# Altium project ArduinoFOC.PrjPCB
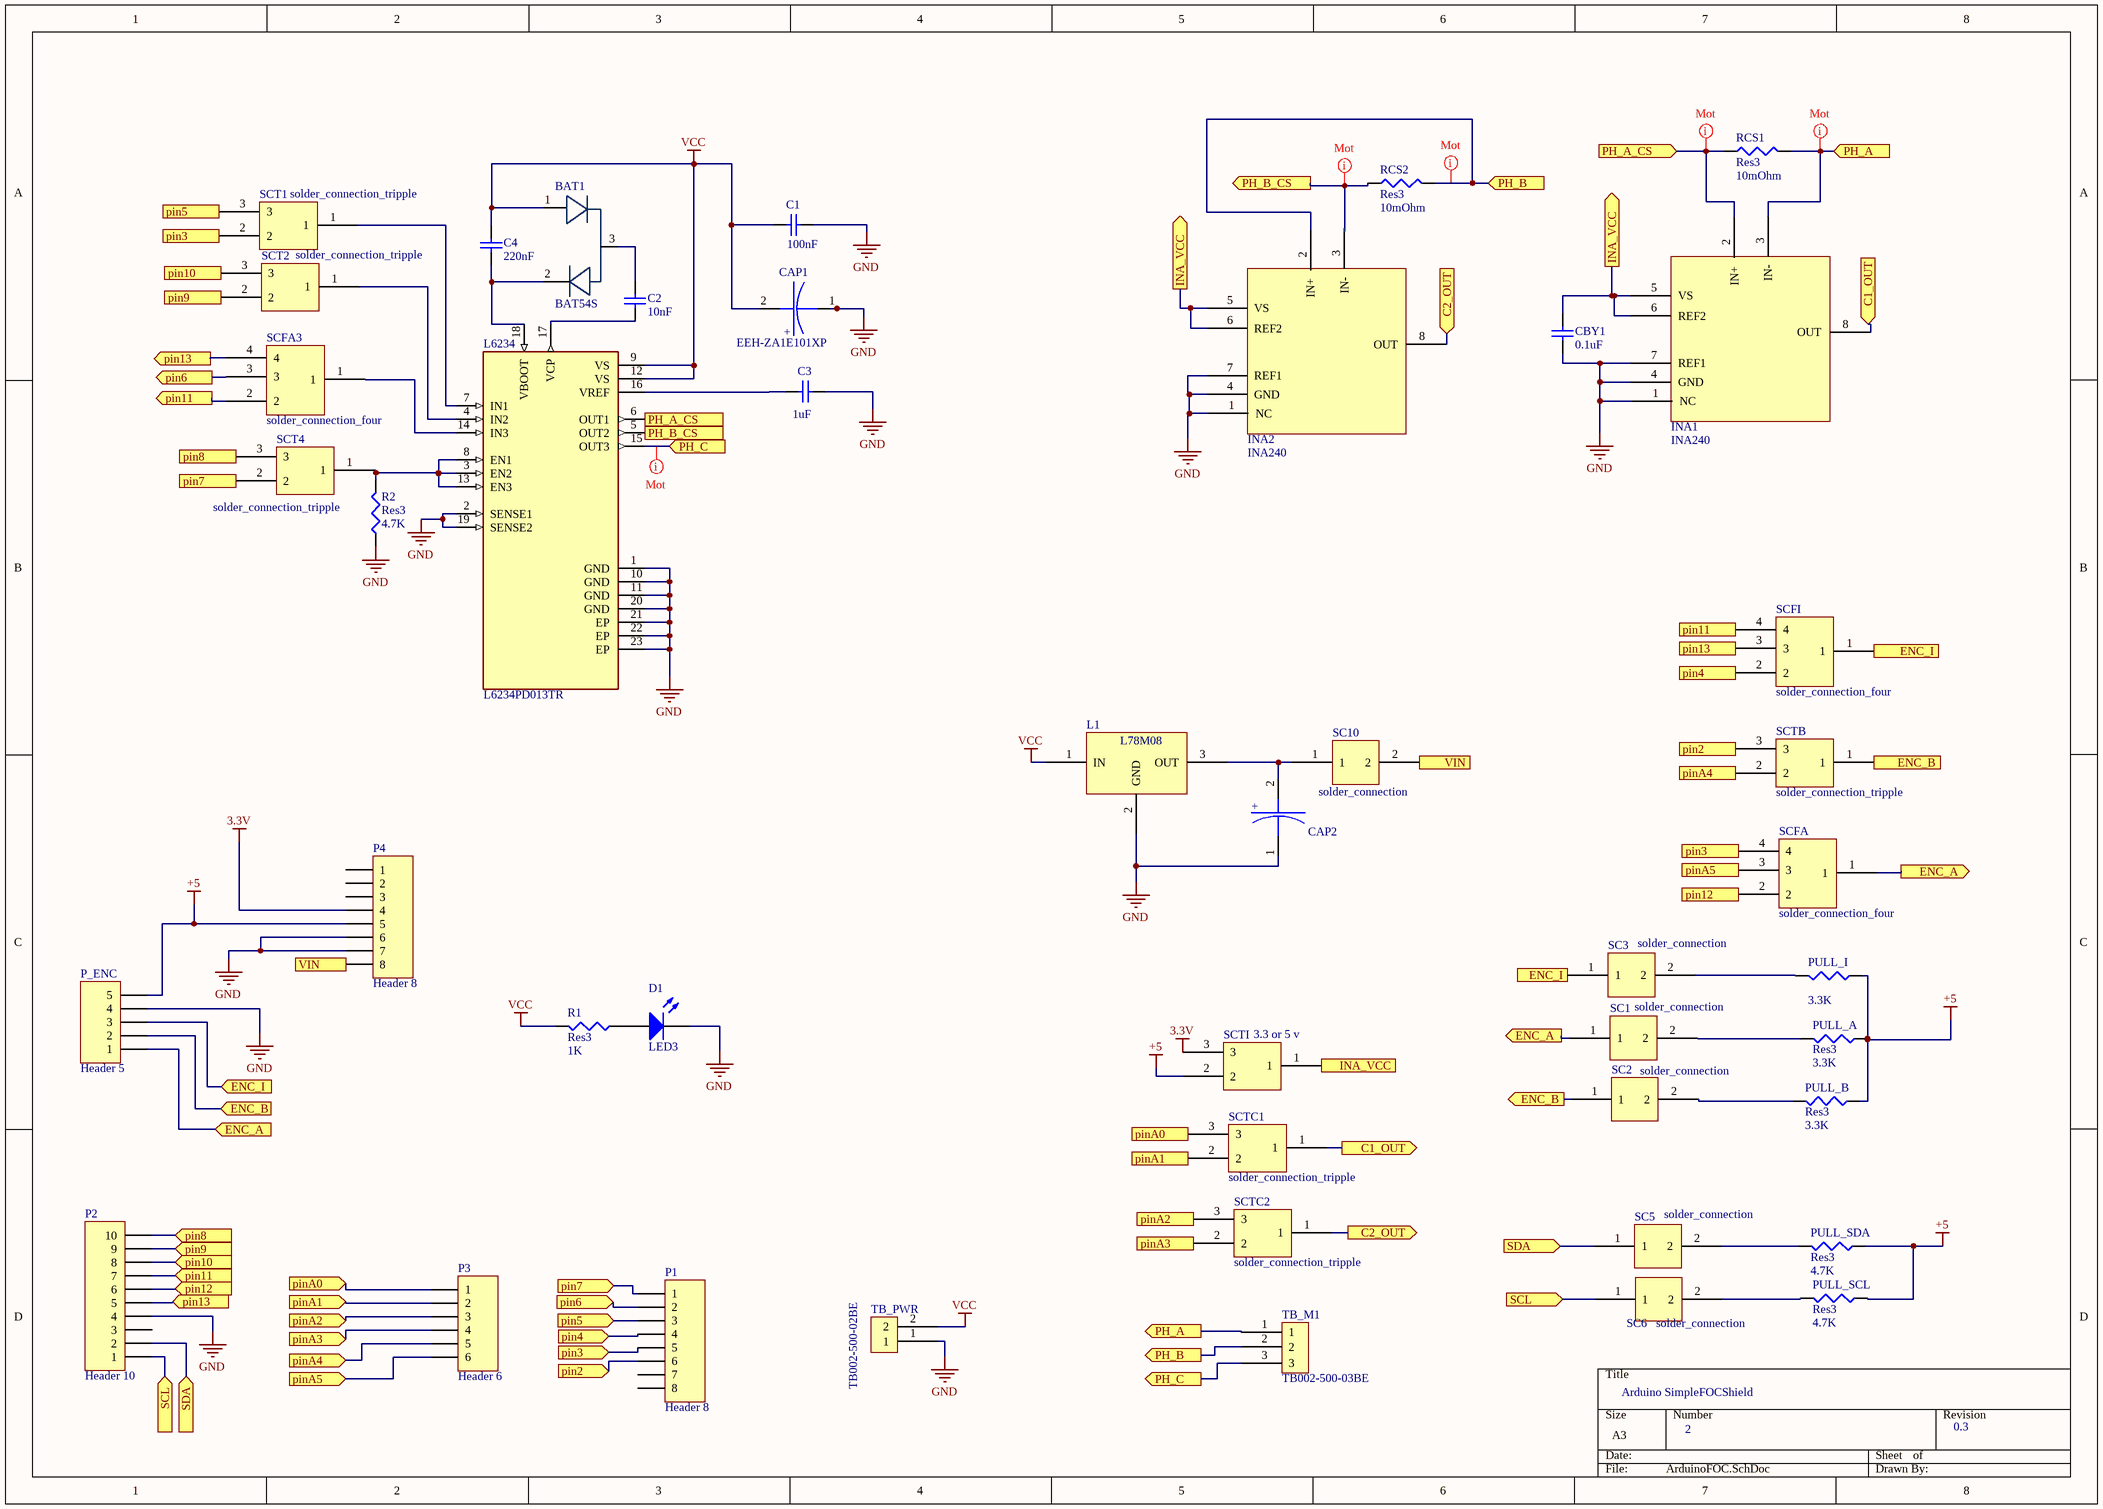
[diagram p0: ArduinoFOC.SchDoc]
1 sheet, 45 parts. Net scope: flat (ports and power ports of the same name join across sheets).
Board file: ArduinoFOC.PcbDoc

## Sheet ArduinoFOC.SchDoc
size A3

### Parts
BAT1  BAT54S  [BAT54s]
C1  value 100nF  [C1206]  (hidden comment: Cap Semi)
C2  value 10nF  [C1206]  (hidden comment: Cap Semi)
C3  value 1uF  [C1206]  (hidden comment: Cap Semi)
C4  value 220nF  [C1206]  (hidden comment: Cap Semi)
CAP1  EEH-ZA1E101XP  [EEH-ZA1E101XP]
CAP2  VZH100M1HTR-0606  [EEH-ZA1E101XP]  (value not drawn)
CBY1  value 0.1uF  [C1206]  (hidden comment: Cap Semi)
D1  LED3  [3.5X2.8X1.9]
INA1  INA240  [INA240]
INA2  INA240  [INA240]
L1  l78M08  [L7805]  (value not drawn)
L6234  L6234PD013TR  [SOIC127P1420X360-21N]
P1  Header 8  [HDR1X8]
P2  Header 10  [HDR1X10]
P3  Header 6  [HDR1X6]
P4  Header 8  [HDR1X8]
P_ENC  Header 5  [HDR1X5]
PULL_A  Res3  value 3.3K  [14-1210]
PULL_B  Res3  value 3.3K  [14-1210]
PULL_I  value 3.3K  [14-1210]  (hidden comment: Res3)
PULL_SCL  Res3  value 4.7K  [14-1210]
PULL_SDA  Res3  value 4.7K  [14-1210]
R1  Res3  value 1K  [14-1210]
R2  Res3  value 4.7K  [14-1210]
RCS1  Res3  value 10mOhm  [RESC6332]
RCS2  Res3  value 10mOhm  [RESC6332]
SC1  solder_connection  [solder_connection]
SC2  solder_connection  [solder_connection]
SC3  solder_connection  [solder_connection]
SC5  solder_connection  [solder_connection]
SC6  solder_connection  [solder_connection]
SC10  solder_connection  [solder_connection]
SCFA  solder_connection_four  [solder_connection_four]
SCFA3  solder_connection_four  [solder_connection_four]
SCFI  solder_connection_four  [solder_connection_four]
SCT1  solder_connection_tripple  [solder_connection_tripple]
SCT2  solder_connection_tripple  [solder_connection_tripple]
SCT4  solder_connection_tripple  [solder_connection_tripple]
SCTB  solder_connection_tripple  [solder_connection_tripple]
SCTC1  solder_connection_tripple  [solder_connection_tripple]
SCTC2  solder_connection_tripple  [solder_connection_tripple]
SCTI  3.3 or 5 v  [solder_connection_tripple]
TB_M1  TB002-500-03BE  [TB002-500-03BE]
TB_PWR  TB002-500-02BE  [TB002-500-02BE]

### Ports
C1_OUT (in), C1_OUT (out), C2_OUT (in), C2_OUT (out), ENC_A (in), ENC_A (out), ENC_B (in), ENC_B (out), ENC_I (in), ENC_I (out), INA_VCC (out), PH_A (in), PH_A (out), PH_A_CS (in), PH_B (in), PH_B (out), PH_B_CS (in), PH_B_CS (out), PH_C (in), PH_C (out), pin2 (in), pin2 (out), pin3 (in), pin3 (out), pin4 (in), pin4 (out), pin5 (in), pin5 (out), pin6 (in), pin6 (out), pin7 (in), pin7 (out), pin8 (in), pin9 (in), pin9 (out), pin10 (in), pin10 (out), pin11 (in), pin11 (out), pin12 (in), pin12 (out), pin13 (in), pin13 (out), pinA0 (in), pinA0 (out), pinA1 (in), pinA1 (out), pinA2 (in), pinA2 (out), pinA3 (in), pinA3 (out), pinA4 (in), pinA4 (out), pinA5 (in), pinA5 (out), SCL (in), SDA (in), VIN (in)

### Nets
3.3V: P4.4 SCTI.3
+5: P4.5 P_ENC.5 PULL_A.1 PULL_B.1 PULL_I.1 PULL_SCL.1 PULL_SDA.1 SCTI.2
GND: C1.2 C3.2 CAP1.1 CAP2.1 CBY1.1 D1.2(K) INA1.1(NC) INA1.4(GND) INA1.7(REF1) INA2.1(NC) INA2.4(GND) INA2.7(REF1) L1.2(GND) L6234.1(GND) L6234.2(SENSE1) L6234.10(GND) L6234.11(GND) L6234.19(SENSE2) L6234.20(GND) L6234.21(EP) L6234.22(EP) L6234.23(EP) P2.4 P4.6 P4.7 P_ENC.4 R2.1 TB_PWR.1
VCC: BAT1.1 C1.1 C4.1 CAP1.2(+) L1.1(IN) L6234.9(VS) L6234.12(VS) R1.2 TB_PWR.2
NetBAT1_2: BAT1.2 C4.2 L6234.18(VBOOT)
NetBAT1_3: BAT1.3 C2.2
NetC2_1: C2.1 L6234.17(VCP)
NetC3_1: C3.1 L6234.16(VREF)
NetCAP2_2: CAP2.2(+) L1.3(OUT) SC10.1
NetCBY1_2: CBY1.2 INA1.5(VS) INA1.6(REF2) INA2.5(VS) INA2.6(REF2) SCTI.1 ; port INA_VCC
NetD1_1: D1.1(A) R1.1
NetINA1_2: INA1.2(IN+) L6234.6(OUT1) RCS1.1 ; port PH_A_CS
NetINA1_3: INA1.3(IN-) RCS1.2 TB_M1.1 ; port PH_A
NetINA1_8: INA1.8(OUT) SCTC1.1 ; port C1_OUT
NetINA2_2: INA2.2(IN+) RCS2.2 TB_M1.2 ; port PH_B
NetINA2_3: INA2.3(IN-) L6234.5(OUT2) RCS2.1 ; port PH_B_CS
NetINA2_8: INA2.8(OUT) SCTC2.1 ; port C2_OUT
NetL6234_3: L6234.3(EN2) L6234.8(EN1) L6234.13(EN3) R2.2 SCT4.1
NetL6234_4: L6234.4(IN2) SCT2.1
NetL6234_7: L6234.7(IN1) SCT1.1
NetL6234_14: L6234.14(IN3) SCFA3.1
NetL6234_15: L6234.15(OUT3) TB_M1.3 ; port PH_C
NetP1_1: P1.1 SCT4.2 ; port pin7
NetP1_2: P1.2 SCFA3.3 ; port pin6
NetP1_3: P1.3 SCT1.3 ; port pin5
NetP1_4: P1.4 SCFI.2 ; port pin4
NetP1_5: P1.5 SCFA.4 SCT1.2 ; port pin3
NetP1_6: P1.6 SCTB.3 ; port pin2
NetP2_1: P2.1 SC6.1 ; port SCL
NetP2_2: P2.2 SC5.1 ; port SDA
NetP2_5: P2.5 SCFA3.4 SCFI.3 ; port pin13
NetP2_6: P2.6 SCFA.2 ; port pin12
NetP2_7: P2.7 SCFA3.2 SCFI.4 ; port pin11
NetP2_8: P2.8 SCT2.3 ; port pin10
NetP2_9: P2.9 SCT2.2 ; port pin9
NetP2_10: P2.10 SCT4.3 ; port pin8
NetP3_1: P3.1 SCTC1.3 ; port pinA0
NetP3_2: P3.2 SCTC1.2 ; port pinA1
NetP3_3: P3.3 SCTC2.3 ; port pinA2
NetP3_4: P3.4 SCTC2.2 ; port pinA3
NetP3_5: P3.5 SCTB.2 ; port pinA4
NetP3_6: P3.6 SCFA.3 ; port pinA5
NetP4_8: P4.8 SC10.2 ; port VIN
NetP_ENC_1: P_ENC.1 SC1.1 SCFA.1 ; port ENC_A
NetP_ENC_2: P_ENC.2 SC2.1 SCTB.1 ; port ENC_B
NetP_ENC_3: P_ENC.3 SC3.1 SCFI.1 ; port ENC_I
NetPULL_A_2: PULL_A.2 SC1.2
NetPULL_B_2: PULL_B.2 SC2.2
NetPULL_I_2: PULL_I.2 SC3.2
NetPULL_SCL_2: PULL_SCL.2 SC6.2
NetPULL_SDA_2: PULL_SDA.2 SC5.2

Not connected (* = marked no-connect by the designer): P1 7 8; P2 3; P4 1 2 3

### Layout directives
net class Mot: NetINA1_2, NetINA1_3, NetINA2_2, NetINA2_3, NetL6234_15

### Notes on the sheet
- Arduino SimpleFOCShield
- 2
- 0.3
- (in symbol l78M08) L78M08

### Library data of the parts
C1-C4 CBY1 = Cap Semi: Capacitor (Semiconductor SIM Model); Published: 8-Jun-2000; LatestRevisionDate: 29-May-2009; LatestRevisionNote: IPC-7351 Footprint Added.; PackageReference: C1206; Publisher: Altium Limited; PackageDescription: Chip Capacitor
CAP2 = EEH-ZA1E101XP: Supplier 1: Mouser; Supplier Part Number 1: 667-EEH-ZA1E101XP
D1 = LED3: Typical BLUE SiC LED; Published: 8-Jun-2000; LatestRevisionDate: 17-Dec-2003; LatestRevisionNote: PCB Footprint replaced.; DatasheetVersion: 16-Apr-2002; PackageVersion: 16-Apr-2002; PackageReference: 3.5X2.8X1.9; Publisher: Altium Limited; PackageDescription: SM LED; 2 C-Bend Leads; Body 3.5 x 2.8 x 1.9 mm, inc leads (LxWxH typ)
L6234 = L6234PD013TR: Motor Driver BiCDMOS Parallel PowerSO-20; MF: STMicroelectronics; Value: *; Digi-Key_Purchase_URL: https://www.digikey.com/product-detail/en/stmicroelectronics/L6234PD013TR/497-5352-1-ND/1154483?utm_source=snapeda&utm_medium=aggregator&utm_campaign=symbol; Package: SO-20 STMicroelectronics; SnapEDA_Link: https://www.snapeda.com/parts/L6234PD013TR/STMicroelectronics/view-part/75337/?ref=snap; Digi-Key_Part_Number: 497-5352-1-ND; MP: L6234PD013TR
P1 P4 = Header 8: Header, 8-Pin; LatestRevisionDate: 17-Jul-2002; LatestRevisionNote: Re-released for DXP Platform.; Publisher: Altium Limited
P2 = Header 10: Header, 10-Pin; LatestRevisionDate: 17-Jul-2002; LatestRevisionNote: Re-released for DXP Platform.; Publisher: Altium Limited
P3 = Header 6: Header, 6-Pin; LatestRevisionDate: 17-Jul-2002; LatestRevisionNote: Re-released for DXP Platform.; Publisher: Altium Limited
P_ENC = Header 5: Header, 5-Pin; LatestRevisionDate: 17-Jul-2002; LatestRevisionNote: Re-released for DXP Platform.; Publisher: Altium Limited
PULL_A PULL_B PULL_I PULL_SCL PULL_SDA R1 R2 RCS1 RCS2 = Res3: Resistor; Published: 8-Jun-2000; LatestRevisionDate: 29-May-2009; LatestRevisionNote: IPC-7351 Footprint Added.; Publisher: Altium Limited; PackageDescription: Chip Resistor
  PULL_A PULL_B PULL_I PULL_SCL PULL_SDA R1 R2: PackageReference: J1-1210
  RCS1 RCS2: PackageReference: J1-2512
SCTI = solder_connection_tripple
BAT1 = BAT54S: Supplier 1: Mouser; Supplier Part Number 1: 512-BAT54S
CAP1 = EEH-ZA1E101XP: Supplier 1: Mouser; Supplier Part Number 1: 667-EEH-ZA1E101XP
INA1 INA2 = INA240: Supplier 1: Mouser; Supplier Part Number 1: 595-INA240A2PWR
TB_M1 = TB002-500-03BE: Supplier 1: Mouser; Supplier Part Number 1: 490-TB002-500-03BE
TB_PWR = TB002-500-02BE: Supplier 1: Mouser; Supplier Part Number 1: 490-TB002-500-02BE